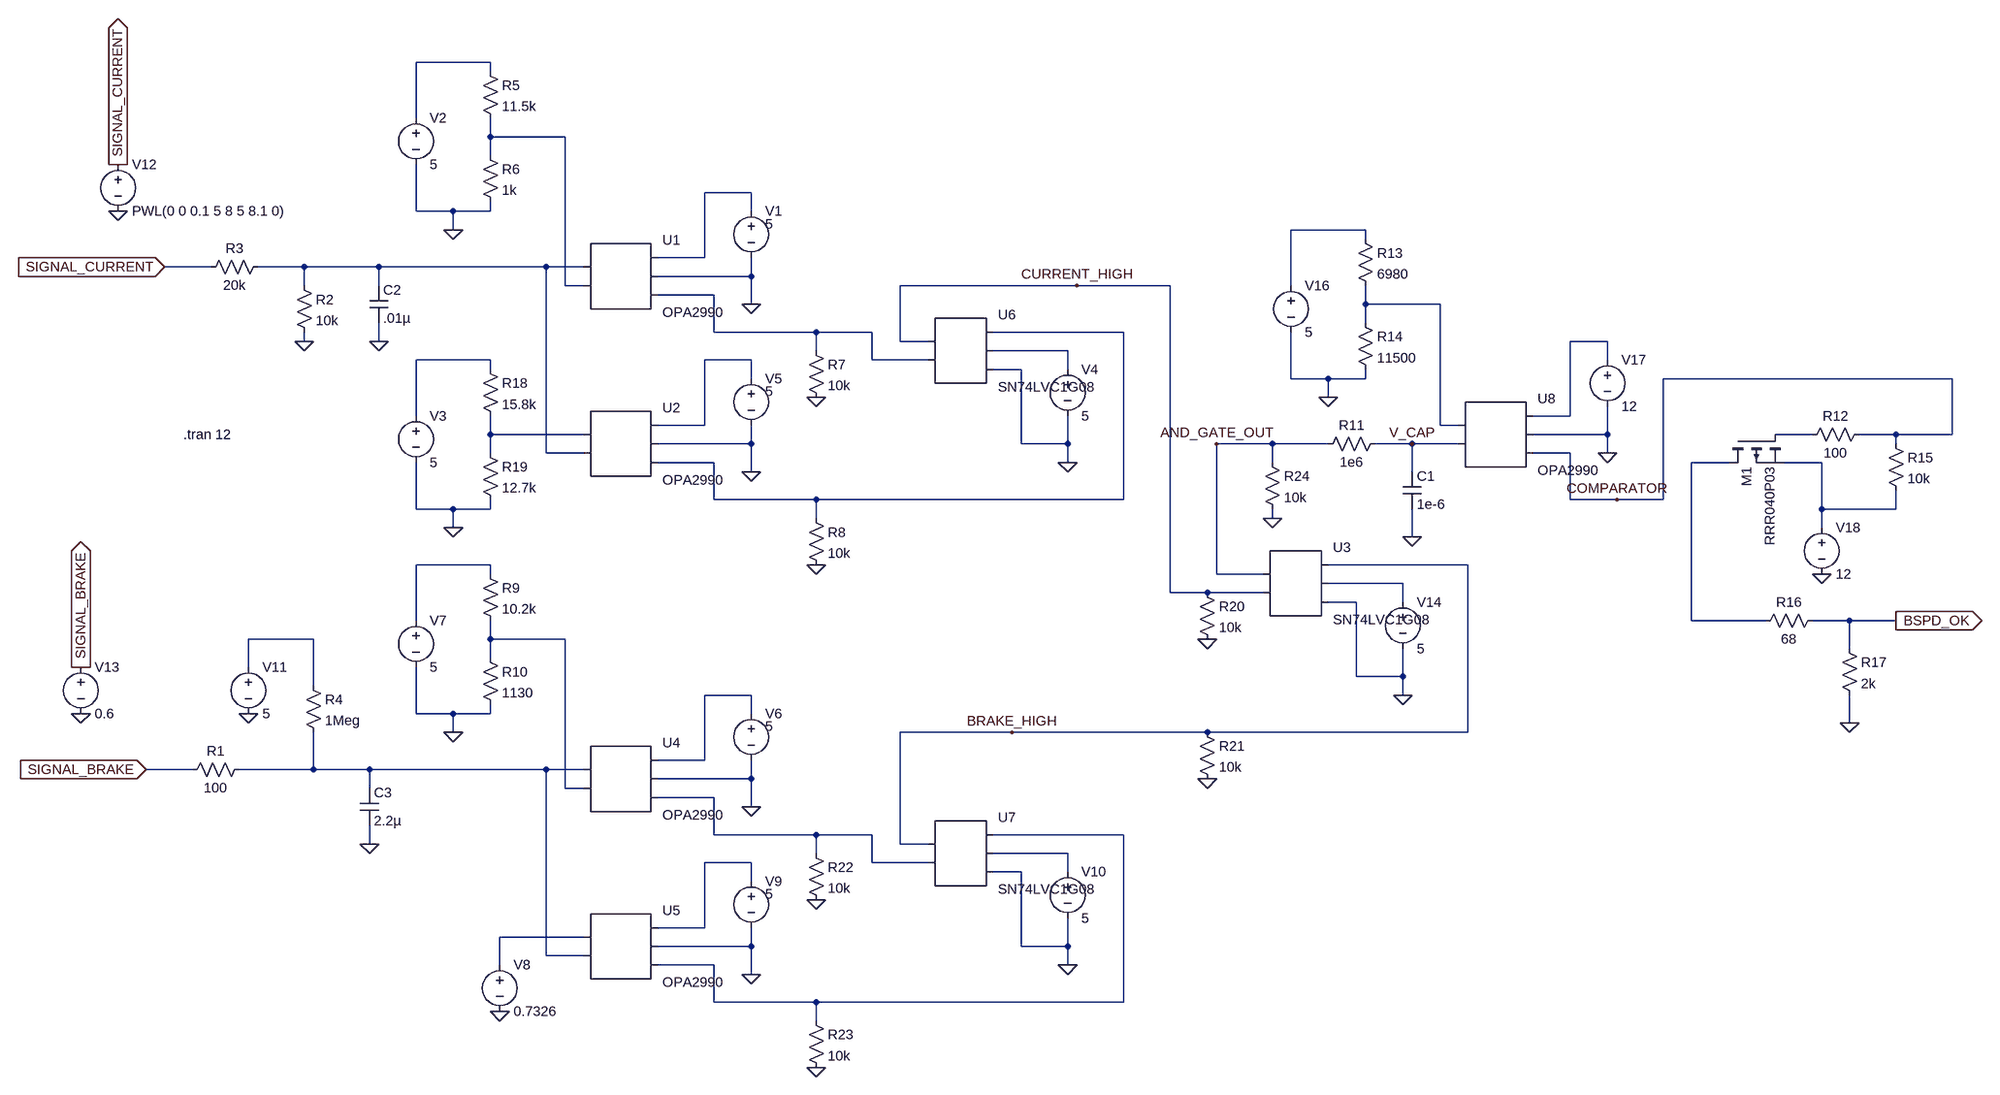
[diagram p0: schematic BSPD_FULL_ETHAN.asc]
BSPD_FULL_ETHAN.asc, the LTspice schematic file:
Version 4
SHEET 1 2984 1776
WIRE 224 -64 96 -64
WIRE 224 -48 224 -64
WIRE 96 32 96 -64
WIRE 224 64 224 32
WIRE 352 64 224 64
WIRE 224 96 224 64
WIRE 672 160 592 160
WIRE 96 192 96 112
WIRE 160 192 96 192
WIRE 224 192 224 176
WIRE 224 192 160 192
WIRE 672 192 672 160
WIRE 160 224 160 192
WIRE 1728 224 1600 224
WIRE 1728 240 1728 224
WIRE 592 272 592 160
WIRE 592 272 512 272
WIRE -256 288 -336 288
WIRE -96 288 -176 288
WIRE 32 288 -96 288
WIRE 320 288 32 288
WIRE 384 288 320 288
WIRE 672 304 672 272
WIRE 672 304 512 304
WIRE -96 320 -96 288
WIRE 32 320 32 288
WIRE 352 320 352 64
WIRE 384 320 352 320
WIRE 1232 320 928 320
WIRE 1392 320 1232 320
WIRE 1600 320 1600 224
WIRE 608 336 512 336
WIRE 672 352 672 304
WIRE 1728 352 1728 320
WIRE 1856 352 1728 352
WIRE 1728 384 1728 352
WIRE 608 400 608 336
WIRE 784 400 608 400
WIRE 880 400 784 400
WIRE 1312 400 1088 400
WIRE -96 416 -96 400
WIRE 32 416 32 384
WIRE 928 416 928 320
WIRE 976 416 928 416
WIRE 2144 416 2080 416
WIRE 784 432 784 400
WIRE 1216 432 1088 432
WIRE 224 448 96 448
WIRE 672 448 592 448
WIRE 880 448 880 400
WIRE 976 448 880 448
WIRE 2144 448 2144 416
WIRE 224 464 224 448
WIRE 1136 464 1088 464
WIRE 1216 464 1216 432
WIRE 672 480 672 448
WIRE 1600 480 1600 400
WIRE 1664 480 1600 480
WIRE 1728 480 1728 464
WIRE 1728 480 1664 480
WIRE 2736 480 2240 480
WIRE 1664 512 1664 480
WIRE 96 544 96 448
WIRE 2080 544 2080 416
WIRE 2080 544 2016 544
WIRE 592 560 592 448
WIRE 592 560 512 560
WIRE 1856 560 1856 352
WIRE 1888 560 1856 560
WIRE 224 576 224 544
WIRE 384 576 224 576
WIRE 2144 576 2144 528
WIRE 2144 576 2016 576
WIRE 2496 576 2432 576
WIRE 2640 576 2576 576
WIRE 2736 576 2736 480
WIRE 2736 576 2640 576
WIRE 672 592 672 560
WIRE 672 592 512 592
WIRE 1136 592 1136 464
WIRE 1216 592 1216 544
WIRE 1216 592 1136 592
WIRE 1568 592 1472 592
WIRE 1664 592 1568 592
WIRE 1808 592 1744 592
WIRE 1888 592 1808 592
WIRE 2640 592 2640 576
WIRE 224 608 224 576
WIRE 320 608 320 288
WIRE 384 608 320 608
WIRE 2080 608 2016 608
WIRE 2144 608 2144 576
WIRE 608 624 512 624
WIRE 1216 624 1216 592
WIRE 1568 624 1568 592
WIRE 2352 624 2288 624
WIRE 2512 624 2448 624
WIRE 672 640 672 592
WIRE 1808 640 1808 592
WIRE 608 688 608 624
WIRE 784 688 608 688
WIRE 1312 688 1312 400
WIRE 1312 688 784 688
WIRE 2080 688 2080 608
WIRE 2160 688 2080 688
WIRE 2240 688 2240 480
WIRE 2240 688 2160 688
WIRE 96 704 96 624
WIRE 160 704 96 704
WIRE 224 704 224 688
WIRE 224 704 160 704
WIRE 2512 704 2512 624
WIRE 2640 704 2640 672
WIRE 2640 704 2512 704
WIRE 784 720 784 688
WIRE 1568 720 1568 704
WIRE 160 736 160 704
WIRE 2512 736 2512 704
WIRE 1808 752 1808 704
WIRE 224 800 96 800
WIRE 1904 800 1664 800
WIRE 224 816 224 800
WIRE 1472 816 1472 592
WIRE 1552 816 1472 816
WIRE 1792 832 1664 832
WIRE 1392 848 1392 320
WIRE 1456 848 1392 848
WIRE 1552 848 1456 848
WIRE 1712 864 1664 864
WIRE 1792 864 1792 832
WIRE 96 896 96 800
WIRE 2288 896 2288 624
WIRE 2416 896 2288 896
WIRE 2560 896 2496 896
WIRE 2640 896 2560 896
WIRE -80 928 -192 928
WIRE 224 928 224 896
WIRE 352 928 224 928
WIRE 2560 944 2560 896
WIRE 224 960 224 928
WIRE -192 976 -192 928
WIRE 1712 992 1712 864
WIRE 1792 992 1792 944
WIRE 1792 992 1712 992
WIRE -80 1008 -80 928
WIRE 672 1024 592 1024
WIRE 1792 1024 1792 992
WIRE 96 1056 96 976
WIRE 160 1056 96 1056
WIRE 224 1056 224 1040
WIRE 224 1056 160 1056
WIRE 672 1056 672 1024
WIRE 2560 1072 2560 1024
WIRE 160 1088 160 1056
WIRE 1120 1088 928 1088
WIRE 1456 1088 1120 1088
WIRE 1904 1088 1904 800
WIRE 1904 1088 1456 1088
WIRE 592 1136 592 1024
WIRE 592 1136 512 1136
WIRE -288 1152 -368 1152
WIRE -80 1152 -80 1088
WIRE -80 1152 -208 1152
WIRE 16 1152 -80 1152
WIRE 320 1152 16 1152
WIRE 384 1152 320 1152
WIRE 672 1168 672 1136
WIRE 672 1168 512 1168
WIRE 16 1184 16 1152
WIRE 352 1184 352 928
WIRE 384 1184 352 1184
WIRE 608 1200 512 1200
WIRE 672 1216 672 1168
WIRE 608 1264 608 1200
WIRE 784 1264 608 1264
WIRE 880 1264 784 1264
WIRE 1312 1264 1088 1264
WIRE 16 1280 16 1248
WIRE 928 1280 928 1088
WIRE 976 1280 928 1280
WIRE 784 1296 784 1264
WIRE 1216 1296 1088 1296
WIRE 672 1312 592 1312
WIRE 880 1312 880 1264
WIRE 976 1312 880 1312
WIRE 1136 1328 1088 1328
WIRE 1216 1328 1216 1296
WIRE 672 1344 672 1312
WIRE 592 1424 592 1312
WIRE 592 1424 512 1424
WIRE 384 1440 240 1440
WIRE 672 1456 672 1424
WIRE 672 1456 512 1456
WIRE 1136 1456 1136 1328
WIRE 1216 1456 1216 1408
WIRE 1216 1456 1136 1456
WIRE 320 1472 320 1152
WIRE 384 1472 320 1472
WIRE 240 1488 240 1440
WIRE 608 1488 512 1488
WIRE 1216 1488 1216 1456
WIRE 672 1504 672 1456
WIRE 608 1552 608 1488
WIRE 784 1552 608 1552
WIRE 1312 1552 1312 1264
WIRE 1312 1552 784 1552
WIRE 784 1584 784 1552
FLAG 672 352 0
FLAG 32 416 0
FLAG -96 416 0
FLAG -192 1056 0
FLAG -336 288 SIGNAL_CURRENT
IOPIN -336 288 In
FLAG -368 1152 SIGNAL_BRAKE
IOPIN -368 1152 In
FLAG -416 192 0
FLAG -416 112 SIGNAL_CURRENT
IOPIN -416 112 Out
FLAG -480 1056 0
FLAG -480 976 SIGNAL_BRAKE
IOPIN -480 976 Out
FLAG 160 224 0
FLAG 1792 1024 0
FLAG 1664 512 0
FLAG 2144 608 0
FLAG 2512 816 0
FLAG 2640 896 BSPD_OK
IOPIN 2640 896 Out
FLAG 2560 1072 0
FLAG 160 736 0
FLAG 672 640 0
FLAG 1216 624 0
FLAG 784 512 0
FLAG 784 800 0
FLAG 672 1216 0
FLAG 160 1088 0
FLAG 672 1504 0
FLAG 1216 1488 0
FLAG 784 1376 0
FLAG 784 1664 0
FLAG 16 1280 0
FLAG 240 1568 0
FLAG 1456 928 0
FLAG 1456 1168 0
FLAG 1568 720 0
FLAG 1808 752 0
FLAG 1232 320 CURRENT_HIGH
FLAG 1120 1088 BRAKE_HIGH
FLAG 1472 592 AND_GATE_OUT
FLAG 1808 592 V_CAP
FLAG 2160 688 COMPARATOR
SYMBOL AutoGenerated/OPA2990 448 304 R0
SYMATTR InstName U1
SYMBOL voltage 672 176 R0
WINDOW 3 24 38 Left 2
SYMATTR Value 5
SYMATTR InstName V1
SYMBOL res -160 272 R90
WINDOW 0 0 56 VBottom 2
WINDOW 3 32 56 VTop 2
SYMATTR InstName R3
SYMATTR Value 20k
SYMBOL cap 16 320 R0
SYMATTR InstName C2
SYMATTR Value .01µ
SYMBOL res -192 1136 R90
WINDOW 0 0 56 VBottom 2
WINDOW 3 32 56 VTop 2
SYMATTR InstName R1
SYMATTR Value 100
SYMBOL voltage -192 960 R0
SYMATTR InstName V11
SYMATTR Value 5
SYMBOL voltage -416 96 R0
WINDOW 123 0 0 Left 0
WINDOW 39 0 0 Left 0
SYMATTR InstName V12
SYMATTR Value PWL(0 0 0.1 5 8 5 8.1 0)
SYMBOL res -112 304 R0
SYMATTR InstName R2
SYMATTR Value 10k
SYMBOL voltage -480 960 R0
WINDOW 123 0 0 Left 0
WINDOW 39 0 0 Left 0
SYMATTR InstName V13
SYMATTR Value 0.6
SYMBOL res -96 992 R0
SYMATTR InstName R4
SYMATTR Value 1Meg
SYMBOL voltage 96 16 R0
SYMATTR InstName V2
SYMATTR Value 5
SYMBOL res 208 -64 R0
SYMATTR InstName R5
SYMATTR Value 11.5k
SYMBOL res 208 80 R0
SYMATTR InstName R6
SYMATTR Value 1k
SYMBOL voltage 1792 848 R0
SYMATTR InstName V14
SYMATTR Value 5
SYMBOL res 1760 576 R90
WINDOW 0 0 56 VBottom 2
WINDOW 3 32 56 VTop 2
SYMATTR InstName R11
SYMATTR Value 1e6
SYMBOL cap 1792 640 R0
SYMATTR InstName C1
SYMATTR Value 1e-6
SYMBOL AutoGenerated/OPA2990 1952 576 R0
SYMATTR InstName U8
SYMBOL voltage 1600 304 R0
SYMATTR InstName V16
SYMATTR Value 5
SYMBOL res 1712 224 R0
SYMATTR InstName R13
SYMATTR Value 6980
SYMBOL res 1712 368 R0
SYMATTR InstName R14
SYMATTR Value 11500
SYMBOL voltage 2144 432 R0
SYMATTR InstName V17
SYMATTR Value 12
SYMBOL voltage 2512 720 R0
SYMATTR InstName V18
SYMATTR Value 12
SYMBOL res 2624 576 R0
SYMATTR InstName R15
SYMATTR Value 10k
SYMBOL res 2512 880 R90
WINDOW 0 0 56 VBottom 2
WINDOW 3 32 56 VTop 2
SYMATTR InstName R16
SYMATTR Value 68
SYMBOL pmos 2352 576 M90
SYMATTR InstName M1
SYMATTR Value RRR040P03
SYMBOL res 2544 928 R0
SYMATTR InstName R17
SYMATTR Value 2k
SYMBOL voltage 96 528 R0
SYMATTR InstName V3
SYMATTR Value 5
SYMBOL res 208 448 R0
SYMATTR InstName R18
SYMATTR Value 15.8k
SYMBOL res 208 592 R0
SYMATTR InstName R19
SYMATTR Value 12.7k
SYMBOL AutoGenerated/OPA2990 448 592 R0
SYMATTR InstName U2
SYMBOL voltage 672 464 R0
WINDOW 3 24 38 Left 2
SYMATTR Value 5
SYMATTR InstName V5
SYMBOL res 768 416 R0
SYMATTR InstName R7
SYMATTR Value 10k
SYMBOL voltage 1216 448 R0
SYMATTR InstName V4
SYMATTR Value 5
SYMBOL res 768 704 R0
SYMATTR InstName R8
SYMATTR Value 10k
SYMBOL AutoGenerated/OPA2990 448 1168 R0
SYMATTR InstName U4
SYMBOL voltage 672 1040 R0
WINDOW 3 24 38 Left 2
SYMATTR Value 5
SYMATTR InstName V6
SYMBOL cap 0 1184 R0
SYMATTR InstName C3
SYMATTR Value 2.2µ
SYMBOL voltage 96 880 R0
SYMATTR InstName V7
SYMATTR Value 5
SYMBOL res 208 800 R0
SYMATTR InstName R9
SYMATTR Value 10.2k
SYMBOL res 208 944 R0
SYMATTR InstName R10
SYMATTR Value 1130
SYMBOL voltage 240 1472 R0
SYMATTR InstName V8
SYMATTR Value 0.7326
SYMBOL AutoGenerated/OPA2990 448 1456 R0
SYMATTR InstName U5
SYMBOL voltage 672 1328 R0
WINDOW 3 24 38 Left 2
SYMATTR Value 5
SYMATTR InstName V9
SYMBOL res 768 1280 R0
SYMATTR InstName R22
SYMATTR Value 10k
SYMBOL voltage 1216 1312 R0
SYMATTR InstName V10
SYMATTR Value 5
SYMBOL res 768 1568 R0
SYMATTR InstName R23
SYMATTR Value 10k
SYMBOL res 1440 832 R0
SYMATTR InstName R20
SYMATTR Value 10k
SYMBOL res 1440 1072 R0
SYMATTR InstName R21
SYMATTR Value 10k
SYMBOL res 1552 608 R0
SYMATTR InstName R24
SYMATTR Value 10k
SYMBOL res 2592 560 R90
WINDOW 0 0 56 VBottom 2
WINDOW 3 32 56 VTop 2
SYMATTR InstName R12
SYMATTR Value 100
SYMBOL AutoGenerated/SN74LVC1G08 1024 432 R0
SYMATTR InstName U6
SYMBOL AutoGenerated/SN74LVC1G08 1024 1296 R0
SYMATTR InstName U7
SYMBOL AutoGenerated/SN74LVC1G08 1600 832 R0
SYMATTR InstName U3
TEXT -304 576 Left 2 !.tran 12

The netlist it stands for:
* BSPD_FULL_ETHAN.asc
* U1: OPA2990 (symbol AutoGenerated/OPA2990 not available, pins judged from their places): pin1=N005 pin2=N002 pin3=N003 pin4=0 pin5=N006
V1 N003 0 5
R3 N005 SIGNAL_CURRENT 20k
C2 N005 0 .01µ
R1 N022 SIGNAL_BRAKE 100
V11 N019 0 5
V12 SIGNAL_CURRENT 0 PWL(0 0 0.1 5 8 5 8.1 0)
R2 N005 0 10k
V13 SIGNAL_BRAKE 0 0.6
R4 N019 N022 1Meg
V2 N001 0 5
R5 N001 N002 11.5k
R6 N002 0 1k
V14 N018 0 5
R11 V_CAP AND_GATE_OUT 1e6
C1 V_CAP 0 1e-6
* U8: OPA2990 (symbol AutoGenerated/OPA2990 not available, pins judged from their places): pin1=N007 pin2=V_CAP pin3=N009 pin4=0 pin5=COMPARATOR
V16 N004 0 5
R13 N004 N007 6980
R14 N007 0 11500
V17 N009 0 12
V18 N016 0 12
R15 COMPARATOR N016 10k
R16 BSPD_OK N015 68
M1 N015 N014 N016 N016 RRR040P03
R17 BSPD_OK 0 2k
V3 N011 0 5
R18 N011 N013 15.8k
R19 N013 0 12.7k
* U2: OPA2990 (symbol AutoGenerated/OPA2990 not available, pins judged from their places): pin1=N013 pin2=N005 pin3=N012 pin4=0 pin5=N008
V5 N012 0 5
R7 N006 0 10k
V4 N010 0 5
R8 N008 0 10k
* U4: OPA2990 (symbol AutoGenerated/OPA2990 not available, pins judged from their places): pin1=N022 pin2=N020 pin3=N021 pin4=0 pin5=N023
V6 N021 0 5
C3 N022 0 2.2µ
V7 N017 0 5
R9 N017 N020 10.2k
R10 N020 0 1130
V8 N027 0 0.7326
* U5: OPA2990 (symbol AutoGenerated/OPA2990 not available, pins judged from their places): pin1=N027 pin2=N022 pin3=N026 pin4=0 pin5=N024
V9 N026 0 5
R22 N023 0 10k
V10 N025 0 5
R23 N024 0 10k
R20 CURRENT_HIGH 0 10k
R21 BRAKE_HIGH 0 10k
R24 AND_GATE_OUT 0 10k
R12 COMPARATOR N014 100
* U6: SN74LVC1G08 (symbol AutoGenerated/SN74LVC1G08 not available, pins judged from their places): pin1=CURRENT_HIGH pin2=N006 pin3=N008 pin4=N010 pin5=0
* U7: SN74LVC1G08 (symbol AutoGenerated/SN74LVC1G08 not available, pins judged from their places): pin1=BRAKE_HIGH pin2=N023 pin3=N024 pin4=N025 pin5=0
* U3: SN74LVC1G08 (symbol AutoGenerated/SN74LVC1G08 not available, pins judged from their places): pin1=AND_GATE_OUT pin2=CURRENT_HIGH pin3=BRAKE_HIGH pin4=N018 pin5=0
.model NMOS NMOS
.model PMOS PMOS
.lib standard.mos
.tran 12
.backanno
.end